# Altium schematic sheet miner_protector.SchDoc
size A4 portrait; SheetNumber: 1; SheetTotal: 1
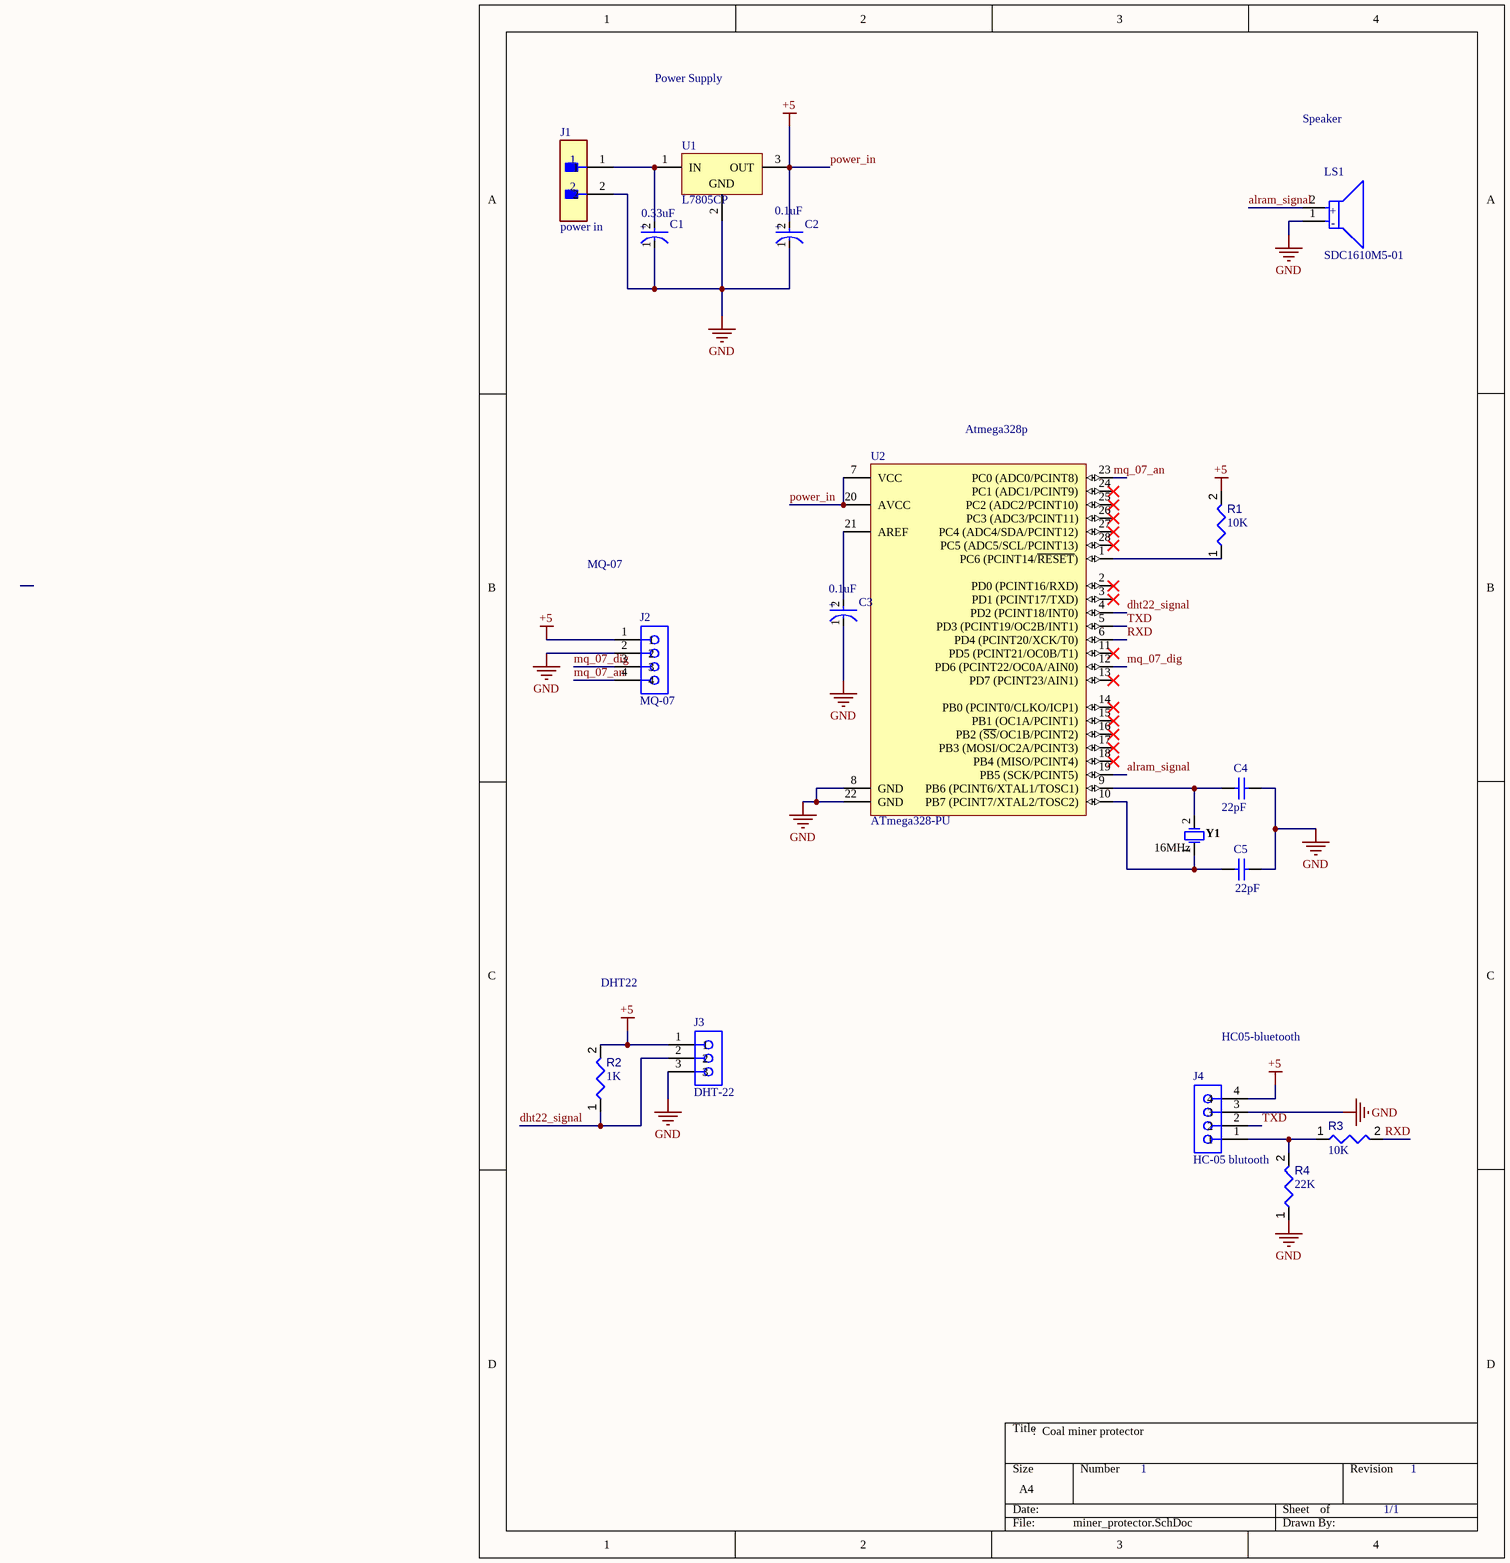
[diagram p0: miner_protector.SchDoc]

## Parts
C1  Capacitance: 0.33uF  [FP-RAD-TH-D_8_0_5-L_15_1-MFG]  (hidden comment: EEUFM1H121LB)
C2  Capacitance: 0.1uF  [FP-RAD-TH-D_8_0_5-L_15_1-MFG]  (hidden comment: EEUFM1H121LB)
C3  Capacitance: 0.1uF  [FP-RAD-TH-D_8_0_5-L_15_1-MFG]  (hidden comment: EEUFM1H121LB)
C4  Capacitance: 22pF  [KEMT-C330C105M5U5TA]  (hidden comment: C330C105M5U5TA)
C5  Capacitance: 22pF  [KEMT-C330C105M5U5TA]  (hidden comment: C330C105M5U5TA)
J1  power in  [FP-TSW-102-07-L-S-MFG]
J2  MQ-07  [SMTC-SLW-104-01-X-S]
J3  DHT-22  [SMTC-BCS-103-X-S-TE]
J4  HC-05 blutooth  [SMTC-SLW-104-01-X-S]
LS1  SDC1610M5-01  [FP-SDC1610M5-01-MFG]
R1  value 10K  [RESA60-630X240]  (hidden comment: MFR-25FBF52-475R)
R2  value 1K  [RESA60-630X240]  (hidden comment: MFR-25FBF52-475R)
R3  value 10K  [RESA60-630X240]  (hidden comment: MFR-25FBF52-475R)
R4  value 22K  [RESA60-630X240]  (hidden comment: MFR-25FBF52-475R)
U1  L7805CP  [TO220FP]
U2  ATmega328-PU  [28P3]
Y1  16MHz  [FOX-FOXSLF160-20]

## Nets
GND: C1.1(C) C2.1(C) C3.1(C) C4.2 C5.2 J1.2 J2.2 J3.3 J4.3 LS1.1(C) R4.1 U1.2(GND) U2.8(GND) U2.22(GND)
power_in: C2.2(A) J2.1 J3.1 J4.4 R1.2 R2.2 U1.3(OUT) U2.7(VCC) U2.20(AVCC)  [also labelled +5]
alram_signal: LS1.2(A) U2.19(PB5_(SCK/PCINT5))
dht22_signal: J3.2 R2.1 U2.4(PD2_(PCINT18/INT0))
mq_07_an: J2.4 U2.23(PC0_(ADC0/PCINT8))
mq_07_dig: J2.3 U2.12(PD6_(PCINT22/OC0A/AIN0))
RXD: R3.2 U2.6(PD4_(PCINT20/XCK/T0))
TXD: J4.2 U2.5(PD3_(PCINT19/OC2B/INT1))
NetC1_2: C1.2(A) J1.1 U1.1(IN)
NetC3_2: C3.2(A) U2.21(AREF)
NetC4_1: C4.1 U2.9(PB6_(PCINT6/XTAL1/TOSC1)) Y1.2
NetC5_1: C5.1 U2.10(PB7_(PCINT7/XTAL2/TOSC2)) Y1.1
NetJ4_1: J4.1 R3.1 R4.2
NetR1_1: R1.1 U2.1(PC6_(PCINT14/~{RESET}))

Not connected (* = marked no-connect by the designer): U2 2(PD0_(PCINT16/RXD))* 3(PD1_(PCINT17/TXD))* 11(PD5_(PCINT21/OC0B/T1))* 13(PD7_(PCINT23/AIN1))* 14(PB0_(PCINT0/CLKO/ICP1))* 15(PB1_(OC1A/PCINT1))* 16(PB2_(~{SS}/OC1B/PCINT2))* 17(PB3_(MOSI/OC2A/PCINT3))* 18(PB4_(MISO/PCINT4))* 24(PC1_(ADC1/PCINT9))* 25(PC2_(ADC2/PCINT10))* 26(PC3_(ADC3/PCINT11))* 27(PC4_(ADC4/SDA/PCINT12))* 28(PC5_(ADC5/SCL/PCINT13))*

## Notes on the sheet
- Power Supply
- Speaker
- (near U2) Atmega328p
- MQ-07
- DHT22
- HC05-bluetooth
- :  Coal miner protector
- 1
- 1/1
- (in symbol CMP-05427-001049-1) +
- (in symbol CMP-08413-000008-1) +; -

## Library data of the parts
C1-C3 = CMP-05427-001049-1: Aluminum Electrolytic Capacitors (Radial Lead Type) 120uF ±20% 50V; Lead Diameter: 0.6mm; Impedance: 45mR; Ripple Current: 1.14A; Life (Hours): 3000Hour; Lead Pitch: 5mm; Height: 15mm; Lead Free: Lead Free; Length: 15mm; Termination: Radial; Tolerance: 20%; Radiation Hardening: No; RoHS Compliant: Yes; Voltage Rating: 50V; Diameter: 8mm; Series: FM; Height - Seated (Max): 0.65inch; Packaging: Ammo Pack; Voltage Rating (DC): 50V; Case/Package: Radial; ESR (Equivalent Series Resistance): 45mR; Min Operating Temperature: -40°C; Package Quantity: 1000; Max Operating Temperature: 105°C; Mount: Through Hole
C4 C5 = CMP-2000-06056-1: Ceramic Capacitor, 1 uF, +/- 20%, 50 V, -10 to 85 degC, 2-Pin THD, RoHS, Bulk; Manufacturer: Kemet; Voltage - Rated: 50V; Temperature Coefficient: Z5U; Catalog Drawings: C330(std); Product Training Modules: CapacitorBasics-TypicalUsesforCapacitors; Online Catalog: GoldenMax™Series; Other Names: 399-4390; PCN Design/Specification: C3yySeriesGoldenMaxLeadConfiguration02/Feb/2015; Thickness (Max): -; Size / Dimension: 0.300"Lx0.150"W(7.62mmx3.81mm); Mounting Technology: ThroughHole; Tolerance: ±20%; Mounting Type: ThroughHole; Datasheet URL: http://www.kemet.com/Lists/ProductCatalog/Attachments/599/KEM_C1051_GOLDMAX_Z5U.pdf; Series: GoldenMax™; Standard Package: 250; Ratings: -; Applications: GeneralPurpose; Package Reference: C330C105M5U5TA; Packaging: Bulk; Category: Capacitors; Package Description: 2-Pin Through Hole Device, Body 7.11 x 4.07 mm; Operating Temperature: 10°C~85°C; Height - Seated (Max): 0.360"(9.14mm); Manufacturer URL: http://www.kemet.com/; Lead Spacing: 0.200"(5.08mm); Features: -; Lead Style: Straight; Package / Case: Radial; Family: CeramicCapacitors; Datasheet Version: 12/2015
J1 = CMP-02766-001428-1: CONN HEADER VERT 2POS 2.54MM; Voltage Rating: 550V; Current Rating: 7.6A; Gender: Male; Number of Contacts: 2; Connector Type: Male Pin; Radiation Hardening: No; Orientation: Straight; Contact Plating: Gold; Max Operating Temperature: 125°C; Mount: Through Hole; Package Quantity: 1; Number of Rows: 1; Housing Material: Polyester; RoHS Compliant: Yes; Length: 5.08mm; Max Voltage Rating (AC): 550V; Pitch: 2.54mm; Packaging: Bulk; Depth: 2.54mm; Termination: Solder; Min Operating Temperature: -55°C; Housing Color: Black; Lead Free: Lead Free; Color: Black; Number of Positions: 2; Width: 2.54mm; Max Current Rating: 7.6A; REACH SVHC: No SVHC; Contact Material: Bronze; Contact Mating Length: 0.23inch; Series: TSW; Contact Type: Male Pin
J2 J4 = CMP-1023-00131-1: Low Profile Socket Strips, Through-hole, Vertical, -55 to 105 degC, 2.54 mm Pitch, 4-Pin, Female, RoHS; Manufacturer: Samtec; PartNumber: SLW-104-01-T-S; Pitch: 2.54 mm; ComponentLink2Description: Datasheet; Temperature Range: -55 to 105 degC; RoHS: True; PackageDescription: Low Profile Socket Strip; PackageVersion: X, 9/1987; Orientation: Vertical; ComponentLink2URL: http://www.samtec.com/documents/webfiles/pdf/SLW.PDF; ComponentLink1URL: http://www.samtec.com; ComponentLink3URL: http://www.samtec.com/documents/webfiles/cpdf/SLW-1XX-01-X-X-MKT.pdf; PackageReference: SLW-104-01-X-S; ComponentLink1Description: Manufacturer URL; DatasheetVersion: F-214; ComponentLink3Description: Package Specification; Mounting Technology: Through-hole
J3 = CMP-1023-00005-1: Tiger Claw(TM) Pass-Through Socket, Vertical, -55 to 125 degC, 2.54 mm Pitch, 3-Pin, Female, RoHS; PartNumber: BCS-103-L-S-TE; Manufacturer: Samtec; Pitch: 2.54 mm; ComponentLink2URL: http://www.samtec.com/documents/webfiles/pdf/BCS.PDF; ComponentLink2Description: Datasheet; Orientation: Vertical; ComponentLink1Description: Manufacturer URL; ComponentLink3Description: Package Specification; Temperature Range: -55 to 125 degC; PackageVersion: BV, 9/1991; PackageReference: BCS-103-X-S-TE; DatasheetVersion: F-214; ComponentLink1URL: http://www.samtec.com; PackageDescription: Box Connector Socket Strip; RoHS: True; Mounting Technology: Through-hole; ComponentLink3URL: http://www.samtec.com/documents/webfiles/cpdf/BCS-1XX-XXX-X-XX-XXX-MKT.pdf
LS1 = CMP-08413-000008-1: AUDIO MAGNETIC INDICATOR 4-8V TH; Nominal Supply Voltage (DC): 5V; Input Type: DC; Max Supply Current: 30mA; Number of Terminals/Pins: 2; Frequency: 2.4kHz; Lead Free: Lead Free; Operating Supply Current: 30mA; Sensing Method: Magnetic; Termination: PC Pins; Number of Pins: 2; Mount: Through Hole; Min Operating Temperature: -10°C; Diameter: 16mm; Series: SDC; Max Operating Temperature: 70°C; Packaging: Tray; Voltage Rating: 5V; Height: 10mm
R1-R4 = CMP-009-00056-4: Axial Resistor, 475 Ohm, +/- 1%, 0.25 W, -55 to 155 degC, 2-Pin THD, RoHS, Bulk; Manufacturer: Yageo; Voltage Rating: 250V; Power: 250mW; Case/Package: Axial; Datasheet URL: http://www.yageo.com/documents/recent/Yageo%20LR_MFR_2013.pdf; Tolerance: 1%; RoHS Compliant: True; Mounting Technology: TH; Packaging: Bulk; Package Description: 2-Pin Axial Lead, Dia 2.4 mm, Body Length 6.3 mm; Max Operating Temperature: 155°C; Package Reference: MFR-25; Datasheet Version: Apr-13; Min Operating Temperature: -55°C; Package Quantity: 200; Manufacturer URL: http://www.yageo.com/
U1 = CMP-0244-00474-1: Positive Voltage Regulator, 5V, 3-Pin TO-220FP; ComponentLink1Description: Manufacturer URL; ComponentLink2Description: Datasheet; DatasheetVersion: 16/11/2011; PackageDescription: TO, Thru-Hole, Vertical, Heatsink Mounted; 3 In-Line Leads; Pitch 2.54 mm; ComponentLink2URL: http://www.st.com/internet/com/TECHNICAL_RESOURCES/TECHNICAL_LITERATURE/DATASHEET/CD00000444.pdf; ComponentLink1URL: http://www.st.com; PackageVersion: 2011; PackageReference: TO220FP
U2 = CMP-0095-00015-2: 8-bit AVR Microcontroller, 32KB Flash, 1KB EEPROM, 2KB SRAM, 28-pin PDIP, Industrial Grade (-40°C to 85°C); ComponentLink3Description: ATmega48A/48PA/88A/88PA/168A/168PA/328/328P Summary; RevisionNote: DatasheetVersion updated. URLs added.; DatasheetVersion: revD, May-2011; ComponentLink1URL: http://www.atmel.com/; PackageVersion: revB, Sep-2001; PackageDescription: 28-lead (0.300"/7.62mm Wide) Plastic Dual Inline Package (PDIP); PackageReference: 28P3; ComponentLink1Description: Manufacturer URL; ComponentLink2Description: ATmega48A/48PA/88A/88PA/168A/168PA/328/328P Datasheet; ComponentLink3URL: http://www.atmel.com/dyn/resources/prod_documents/8271S.pdf; ComponentLink2URL: http://www.atmel.com/dyn/resources/prod_documents/8271.pdf
Y1 = CMP-1749-00003-1: Resistance Weld Thru-Hole Crystal, 16 MHz, -20 to 70 degC, 2-Pin THD, RoHS, Bulk; Voltage Rating: 250 V; Tolerance: 1%; Resistance: 221 kohm; Case\Package: Axial; Power Rating: 250 mW; RoHSCompliant: true; Package Quantity: 200; Packaging: Bulk; Min Operating Temperature: -55 degC; DatasheetVersion: Mar-15; ComponentLink1URL: http://www.foxonline.com/; Max Operating Temperature: 155 degC; PackageReference: FOXSLF160-20; Mount: Through Hole; PackageDescription: 2-Pin Through Hole Device, Body 11.35 x 4.65 mm; ComponentLink1Description: Manufacturer URL; ComponentLink2URL: http://www.foxonline.com/pdfs/hc49slf.pdf; ComponentLink2Description: Datasheet; Length: 0.248 inch